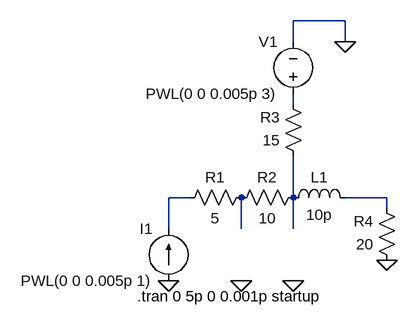
[diagram p0: schematic Example1.asc]
Example1.asc, the LTspice schematic file:
Version 4
SHEET 1 880 680
WIRE 304 -224 224 -224
WIRE 224 -192 224 -224
WIRE 304 -192 304 -224
WIRE 224 -96 224 -112
WIRE 64 48 32 48
WIRE 224 48 224 -16
WIRE 368 48 304 48
WIRE 368 64 368 48
WIRE 32 96 32 48
WIRE 144 96 144 48
WIRE 224 96 224 48
FLAG 368 144 0
FLAG 224 176 0
FLAG 144 176 0
FLAG 32 176 0
FLAG 304 -192 0
SYMBOL res 160 32 R90
WINDOW 0 0 56 VBottom 2
WINDOW 3 32 56 VTop 2
SYMATTR InstName R1
SYMATTR Value 5
SYMBOL res 240 32 R90
WINDOW 0 0 56 VBottom 2
WINDOW 3 32 56 VTop 2
SYMATTR InstName R2
SYMATTR Value 10
SYMBOL res 240 0 R180
WINDOW 0 36 76 Left 2
WINDOW 3 36 40 Left 2
SYMATTR InstName R3
SYMATTR Value 15
SYMBOL res 384 160 R180
WINDOW 0 36 76 Left 2
WINDOW 3 36 40 Left 2
SYMATTR InstName R4
SYMATTR Value 20
SYMBOL ind 208 64 R270
WINDOW 0 32 56 VTop 2
WINDOW 3 5 56 VBottom 2
SYMATTR InstName L3
SYMATTR Value 10p
SYMATTR SpiceLine Rser=0 Rpar=0 Cpar=0
SYMBOL ind 208 80 r0
SYMATTR InstName L2
SYMATTR Value 20p
SYMATTR SpiceLine Rser=0 Rpar=0 Cpar=0
SYMBOL ind 128 80 r0
SYMATTR InstName L1
SYMATTR Value 10p
SYMATTR SpiceLine Rser=0 Rpar=0 Cpar=0
SYMBOL current 32 176 R180
WINDOW 0 24 80 Left 2
WINDOW 3 24 0 Left 2
WINDOW 123 0 0 Left 2
WINDOW 39 0 0 Left 2
SYMATTR InstName I1
SYMATTR Value PWL(0 0 0.005p 1)
SYMBOL voltage 224 -96 R180
WINDOW 0 24 96 Left 2
WINDOW 3 24 16 Left 2
WINDOW 123 0 0 Left 2
WINDOW 39 0 0 Left 2
SYMATTR InstName V1
SYMATTR Value PWL(0 0 0.005p 3)
TEXT -16 200 Left 2 !.tran 0 5p 0 0.001p startup

The netlist it stands for:
* Example1.asc
R1 N005 N002 5
R2 N003 N005 10
R3 N003 N001 15
R4 0 N004 20
L1 N003 N004 10p Rser=0 Rpar=0 Cpar=0
I1 0 N002 PWL(0 0 0.005p 1)
V1 N001 0 PWL(0 0 0.005p 3)
.tran 0 5p 0 0.001p startup
.backanno
.end